# Altium project HPBIController.PrjPCB (part 2 of 2)

## Sheet Power.SchDoc: 02290_Sonoma_Controller
size B; ApprovedBy: J Johnson; CheckedBy: J Johnson; Author: sdfasdfdfAEFfasdFfaF; DrawnBy: J Johnson; Organization: Opsero Electronic Design; Address1: 21-915 Av. Marguerite-Bourgeoys; Address2: Québec (QC); Address3: G1S 3X4; DocumentNumber: OP009-001-SCH; Revision: B-1; SheetNumber: 13; SheetTotal: 16; Tel1: (581) 308-8830; Tel2: (581) 308-8830; Project: 02290_Sonoma_Controller; CheckedDate: 2013-12-13; Sheet: Power Supplies; PageSetup: Record=PageOptions|CenterHorizontal=True|CenterVertical=True|PrintScale=1.08|XCorrection=1.00|YCorrection=1.00|PrintKind=0|BorderSize=5000000|LeftOffset=0|BottomOffset=0|Orientation=2|PaperLength=1000|PaperWidth=1000|Scale=100|PaperSource=7|PrintQuality=-4|MediaType=1|DitherType=10|PaperKind=Tabloid     [11 x 17 in]|PrintScaleMode=1; DrawDate: 2013-12-13; SchTitle: 02290_Sonoma_Controller; RevDescription: Removed QSPI, JP4/5, temp mon, JP6, U31; RevDate: 2019-05-24; RevBy: J Johnson; RevDescription2: Replaced D1 with RB521S30, J2 with L834-1G1T-S7; RevDescription3: Replaced FETs with TSM900N06CW RPG
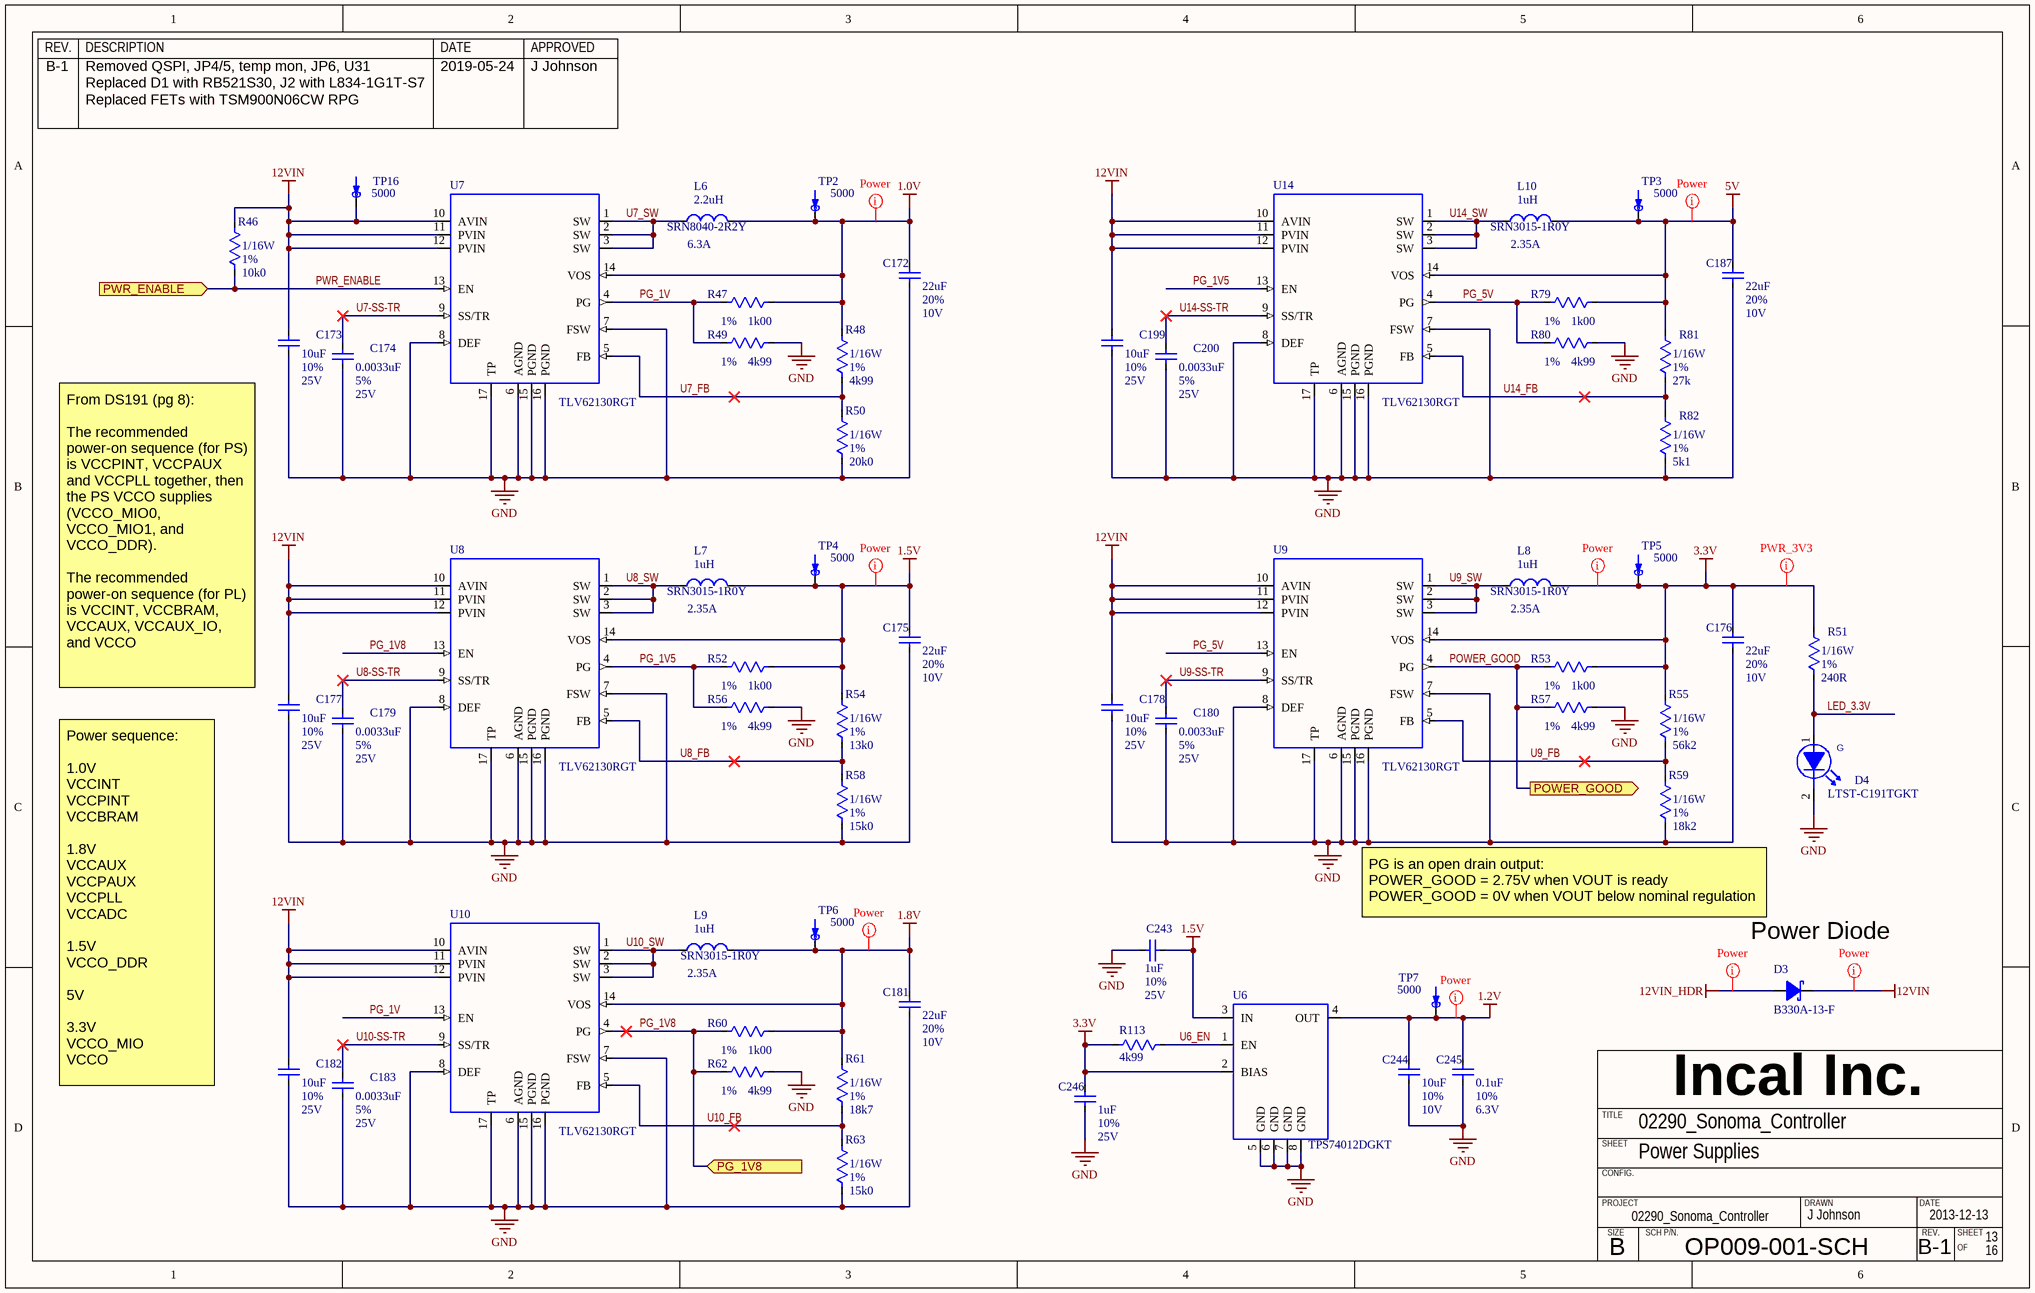
[diagram p3: Power.SchDoc]

### Parts
C172  value 22uF  Tolerance: 20%  Voltage: 10V  [CAPC2013X125N]  (hidden comment: CAPACITOR_NP_TYPE1)
C173  value 10uF  Tolerance: 10%  Voltage: 25V  [CAPC3216X127N]  (hidden comment: CAPACITOR_NP_TYPE1)
C174  value 0.0033uF  Tolerance: 5%  Voltage: 25V  [CAPC1005X55N]  (hidden comment: CAPACITOR_NP_TYPE1)
C175  value 22uF  Tolerance: 20%  Voltage: 10V  [CAPC2013X125N]  (hidden comment: CAPACITOR_NP_TYPE1)
C176  value 22uF  Tolerance: 20%  Voltage: 10V  [CAPC2013X125N]  (hidden comment: CAPACITOR_NP_TYPE1)
C177  value 10uF  Tolerance: 10%  Voltage: 25V  [CAPC3216X127N]  (hidden comment: CAPACITOR_NP_TYPE1)
C178  value 10uF  Tolerance: 10%  Voltage: 25V  [CAPC3216X127N]  (hidden comment: CAPACITOR_NP_TYPE1)
C179  value 0.0033uF  Tolerance: 5%  Voltage: 25V  [CAPC1005X55N]  (hidden comment: CAPACITOR_NP_TYPE1)
C180  value 0.0033uF  Tolerance: 5%  Voltage: 25V  [CAPC1005X55N]  (hidden comment: CAPACITOR_NP_TYPE1)
C181  value 22uF  Tolerance: 20%  Voltage: 10V  [CAPC2013X125N]  (hidden comment: CAPACITOR_NP_TYPE1)
C182  value 10uF  Tolerance: 10%  Voltage: 25V  [CAPC3216X127N]  (hidden comment: CAPACITOR_NP_TYPE1)
C183  value 0.0033uF  Tolerance: 5%  Voltage: 25V  [CAPC1005X55N]  (hidden comment: CAPACITOR_NP_TYPE1)
C187  value 22uF  Tolerance: 20%  Voltage: 10V  [CAPC2013X125N]  (hidden comment: CAPACITOR_NP_TYPE1)
C199  value 10uF  Tolerance: 10%  Voltage: 25V  [CAPC3216X127N]  (hidden comment: CAPACITOR_NP_TYPE1)
C200  value 0.0033uF  Tolerance: 5%  Voltage: 25V  [CAPC1005X55N]  (hidden comment: CAPACITOR_NP_TYPE1)
C243  value 1uF  Tolerance: 10%  Voltage: 25V  [CAPC1608X38N]  (hidden comment: CAPACITOR_NP_TYPE1)
C244  value 10uF  Tolerance: 10%  Voltage: 10V  [CAPC1608X38N]  (hidden comment: CAPACITOR_NP_TYPE1)
C245  value 0.1uF  Tolerance: 10%  Voltage: 6.3V  [CAPC0603X33N]  (hidden comment: CAPACITOR_NP_TYPE1)
C246  value 1uF  Tolerance: 10%  Voltage: 25V  [CAPC1608X38N]  (hidden comment: CAPACITOR_NP_TYPE1)
D3  Mfg Part Number 1: B330A-13-F  [DIOM4629X230N]  (hidden comment: DIODE_SCHOTTKY_TYPE1)
D4  Mfg Part Number 1: LTST-C191TGKT  [LEDM1608X38N-GRN]  (hidden comment: LED_GRN)
L6  value 2.2uH  Current: 6.3A  Mfg Part Number 1: SRN8040-2R2Y  [INDM800800X400N]  (hidden comment: INDUCTOR_TYPE1)
L7  value 1uH  Current: 2.35A  Mfg Part Number 1: SRN3015-1R0Y  [INDM300300X150N]  (hidden comment: INDUCTOR_TYPE1)
L8  value 1uH  Current: 2.35A  Mfg Part Number 1: SRN3015-1R0Y  [INDM300300X150N]  (hidden comment: INDUCTOR_TYPE1)
L9  value 1uH  Current: 2.35A  Mfg Part Number 1: SRN3015-1R0Y  [INDM300300X150N]  (hidden comment: INDUCTOR_TYPE1)
L10  value 1uH  Current: 2.35A  Mfg Part Number 1: SRN3015-1R0Y  [INDM300300X150N]  (hidden comment: INDUCTOR_TYPE1)
R46  value 10k0  Power: 1/16W  Tolerance: 1%  [RESC1005X33N]  (hidden comment: *)
R47  value 1k00  Tolerance: 1%  [RESC1005X33N]  (hidden comment: *)
R48  value 4k99  Power: 1/16W  Tolerance: 1%  [RESC1005X33N]  (hidden comment: *)
R49  value 4k99  Tolerance: 1%  [RESC1005X33N]  (hidden comment: *)
R50  value 20k0  Power: 1/16W  Tolerance: 1%  [RESC1005X33N]  (hidden comment: *)
R51  value 240R  Power: 1/16W  Tolerance: 1%  [RESC1005X33N]  (hidden comment: *)
R52  value 1k00  Tolerance: 1%  [RESC1005X33N]  (hidden comment: *)
R53  value 1k00  Tolerance: 1%  [RESC1005X33N]  (hidden comment: *)
R54  value 13k0  Power: 1/16W  Tolerance: 1%  [RESC1005X33N]  (hidden comment: *)
R55  value 56k2  Power: 1/16W  Tolerance: 1%  [RESC1005X33N]  (hidden comment: *)
R56  value 4k99  Tolerance: 1%  [RESC1005X33N]  (hidden comment: *)
R57  value 4k99  Tolerance: 1%  [RESC1005X33N]  (hidden comment: *)
R58  value 15k0  Power: 1/16W  Tolerance: 1%  [RESC1005X33N]  (hidden comment: *)
R59  value 18k2  Power: 1/16W  Tolerance: 1%  [RESC1005X33N]  (hidden comment: *)
R60  value 1k00  Tolerance: 1%  [RESC1005X33N]  (hidden comment: *)
R61  value 18k7  Power: 1/16W  Tolerance: 1%  [RESC1005X33N]  (hidden comment: *)
R62  value 4k99  Tolerance: 1%  [RESC1005X33N]  (hidden comment: *)
R63  value 15k0  Power: 1/16W  Tolerance: 1%  [RESC1005X33N]  (hidden comment: *)
R79  value 1k00  Tolerance: 1%  [RESC1005X33N]  (hidden comment: *)
R80  value 4k99  Tolerance: 1%  [RESC1005X33N]  (hidden comment: *)
R81  value 27k  Power: 1/16W  Tolerance: 1%  [RESC1005X33N]  (hidden comment: *)
R82  value 5k1  Power: 1/16W  Tolerance: 1%  [RESC1005X33N]  (hidden comment: *)
R113  value 4k99  [RESC1005X33N]  (hidden comment: *)
TP2  value 5000  [KEY_5000]  (hidden comment: TEST_POINT_TYPE4)
TP3  value 5000  [KEY_5000]  (hidden comment: TEST_POINT_TYPE4)
TP4  value 5000  [KEY_5000]  (hidden comment: TEST_POINT_TYPE4)
TP5  value 5000  [KEY_5000]  (hidden comment: TEST_POINT_TYPE4)
TP6  value 5000  [KEY_5000]  (hidden comment: TEST_POINT_TYPE4)
TP7  value 5000  [KEY_5000]  (hidden comment: TEST_POINT_TYPE4)
TP16  value 5000  [KEY_5000]  (hidden comment: TEST_POINT_TYPE4)
U6  Mfg Part Number 1: TPS74012DGKT  [SOP65P490X110-8N]  (hidden comment: TPS740XXDGK)
U7  TLV62130RGT  [QFN50P300X300X100-17N]
U8  TLV62130RGT  [QFN50P300X300X100-17N]
U9  TLV62130RGT  [QFN50P300X300X100-17N]
U10  TLV62130RGT  [QFN50P300X300X100-17N]
U14  TLV62130RGT  [QFN50P300X300X100-17N]

### Ports
PG_1V8 (in), POWER_GOOD (out), PWR_ENABLE (in)

### Nets
1.0V: C172.1 L6.2 R47.2 R48.2 TP2.1 U7.14(VOS)
1.2V: C244.1 C245.1 TP7.1 U6.4(OUT)
1.5V: C175.1 C243.1 L7.2 R52.2 R54.2 TP4.1 U6.3(IN) U8.14(VOS)
1.8V: C181.1 L9.2 R60.2 R61.2 TP6.1 U10.14(VOS)
3.3V: C176.1 C246.1 L8.2 R51.1 R53.2 R55.2 R113.2 TP5.1 U6.2(BIAS) U9.14(VOS)
5V: C187.1 L10.2 R79.2 R81.2 TP3.1 U14.14(VOS)
12VIN: C173.1 C177.1 C178.1 C182.1 C199.1 D3.2(K) R46.2 TP16.1 U7.10(AVIN) U7.11(PVIN) U7.12(PVIN) U8.10(AVIN) U8.11(PVIN) U8.12(PVIN) U9.10(AVIN) U9.11(PVIN) U9.12(PVIN) U10.10(AVIN) U10.11(PVIN) U10.12(PVIN) U14.10(AVIN) U14.11(PVIN) U14.12(PVIN)
12VIN_HDR: D3.1(A)
GND: C172.2 C173.2 C174.2 C175.2 C176.2 C177.2 C178.2 C179.2 C180.2 C181.2 C182.2 C183.2 C187.2 C199.2 C200.2 C243.2 C244.2 C245.2 C246.2 D4.2(K) R49.2 R50.1 R56.2 R57.2 R58.1 R59.1 R62.2 R63.1 R80.2 R82.1 U6.5(GND) U6.6(GND) U6.7(GND) U6.8(GND) U7.6(AGND) U7.7(FSW) U7.8(DEF) U7.15(PGND) U7.16(PGND) U7.17(TP) U8.6(AGND) U8.7(FSW) U8.8(DEF) U8.15(PGND) U8.16(PGND) U8.17(TP) U9.6(AGND) U9.7(FSW) U9.8(DEF) U9.15(PGND) U9.16(PGND) U9.17(TP) U10.6(AGND) U10.7(FSW) U10.8(DEF) U10.15(PGND) U10.16(PGND) U10.17(TP) U14.6(AGND) U14.7(FSW) U14.8(DEF) U14.15(PGND) U14.16(PGND) U14.17(TP)
LED_3.3V: D4.1(A) R51.2
PG_1V: R47.1 R49.1 U7.4(PG) U10.13(EN)
PG_1V5: R52.1 R56.1 U8.4(PG) U14.13(EN)
PG_1V8: R60.1 R62.1 U8.13(EN) U10.4(PG) ; port PG_1V8
PG_5V: R79.1 R80.1 U9.13(EN) U14.4(PG)
POWER_GOOD: R53.1 R57.1 U9.4(PG) ; port POWER_GOOD
PWR_ENABLE: R46.1 U7.13(EN) ; port PWR_ENABLE
U6_EN: R113.1 U6.1(EN)
U7-SS-TR: C174.1 U7.9(SS/TR)
U7_FB: R48.1 R50.2 U7.5(FB)
U7_SW: L6.1 U7.1(SW) U7.2(SW) U7.3(SW)
U8-SS-TR: C179.1 U8.9(SS/TR)
U8_FB: R54.1 R58.2 U8.5(FB)
U8_SW: L7.1 U8.1(SW) U8.2(SW) U8.3(SW)
U9-SS-TR: C180.1 U9.9(SS/TR)
U9_FB: R55.1 R59.2 U9.5(FB)
U9_SW: L8.1 U9.1(SW) U9.2(SW) U9.3(SW)
U10-SS-TR: C183.1 U10.9(SS/TR)
U10_FB: R61.1 R63.2 U10.5(FB)
U10_SW: L9.1 U10.1(SW) U10.2(SW) U10.3(SW)
U14-SS-TR: C200.1 U14.9(SS/TR)
U14_FB: R81.1 R82.2 U14.5(FB)
U14_SW: L10.1 U14.1(SW) U14.2(SW) U14.3(SW)

### Layout directives
net class Power_3V3: 3.3V
net class Power: 1.0V, 1.2V, 1.5V, 1.8V, 3.3V, 5V, 12VIN, 12VIN_HDR

### Notes on the sheet
- From DS191 (pg 8):
  The recommended power-on sequence (for PS) is VCCPINT, VCCPAUX and VCCPLL together, then the PS VCCO supplies (VCCO_MIO0, VCCO_MIO1, and VCCO_DDR).
  The recommended power-on sequence (for PL) is VCCINT, VCCBRAM, VCCAUX, VCCAUX_IO, and VCCO
- (near R59) PG is an open drain output:
  POWER_GOOD = 2.75V when VOUT is ready
  POWER_GOOD = 0V when VOUT below nominal regulation
- (near D3) Power Diode
- Power sequence:
  1.0V
  VCCINT
  VCCPINT
  VCCBRAM
  1.8V
  VCCAUX
  VCCPAUX
  VCCPLL
  VCCADC
  1.5V
  VCCO_DDR
  5V
  3.3V
  VCCO_MIO
  VCCO
- REV.
- DESCRIPTION
- DATE
- APPROVED
- Incal Inc.
- SHEET
- TITLE
- CONFIG.
- PROJECT
- SIZE
- SCH P/N.
- DRAWN
- B
- OF
- (in symbol LTST-C191TGKT) G

### Library data of the parts
C172 C175 C176 C181 C187 = C0805_22uF_20%_10V_X5R: Capacitor ceramic, X5R, 22uF, 10V, 20%, -55 to +85 C, EIA0805; Manufacturer 1: Taiyo; Mfg Part Number 1: LMK212BJ226MG-T; EIA(I) Package: 0805; EIA(M) Package: 2012; ASSY: USED; Status: Active; Power: *; Current: *; Part Ref: C0805_22uF_20%_10V_X5R; Comment_1: *; RoHs: True; Operating Temp: -55 to +85 C
C173 C177 C178 C182 C199 = C1206_10uF_10%_25V_X5R: Capacitor ceramic, X5R, 10uF, 25V, 10%, -55 to +125 C, EIA1206; Manufacturer 1: AVX; Mfg Part Number 1: 12063D106KAT2A; EIA(I) Package: 1206; EIA(M) Package: 3216; ASSY: USED; Status: Active; Power: *; Current: *; Part Ref: C1206_10uF_10%_25V_X5R; Comment_1: *; RoHs: True; Operating Temp: -55 to +125 C
C174 C179 C180 C183 C200 = C0402_0.0033uF_5%_25V_X7R: Capacitor ceramic, X7R, 0.0033uF, 25V, 5%, -55 to +85 C, EIA0402; Manufacturer 1: AVX; Mfg Part Number 1: 04023C332JAT2A; EIA(I) Package: 0402; EIA(M) Package: 1005; ASSY: USED; Status: Active; Power: *; Current: *; Part Ref: C0402_0.0033uF_5%_25V_X7R; Comment_1: *; RoHs: True; Operating Temp: -55 to +85 C
C243 C246 = C0603_1uF_10%_25V_X5R: Capacitor ceramic, X5R, 1uF, 25V, 10%, -55 to +85 C, EIA(M)1608; Manufacturer 1: TDK; Mfg Part Number 1: C1608X5R1E105K080AC; EIA(I) Package: 0603; EIA(M) Package: 1608; ASSY: USED; Status: Active; Power: *; Current: *; Part Ref: C0603_1uF_10%_25V_X5R; Comment_1: *; RoHs: True; Operating Temp: -55 to +85 C; Datasheet 1: ..\datasheet\Capacitor\TDK\C Series\2012-10-26
C244 = C0603_10uF_10%_10V_X5R: Capacitor ceramic, X5R, 10uF, 10V, 10%, -55 to +85 C, EIA0603; Manufacturer 1: TDK Corporation; Mfg Part Number 1: C1608X5R1A106K080AC; EIA(I) Package: 0603; EIA(M) Package: 1608; ASSY: USED; Status: Active; Power: *; Current: *; Part Ref: C0603_10uF_10%_10V_X5R; Comment_1: *; RoHs: True; Operating Temp: -55 to +85 C
C245 = C0201_0.1uF_10%_6.3V_X5R: Capacitor ceramic, X5R, 0.1uF, 6.3V, 10%, -55 to +125 C, EIA0201; Manufacturer 1: Murata; Mfg Part Number 1: GRM033R60J104KE19D; EIA(I) Package: 0201; EIA(M) Package: 0603; ASSY: USED; Status: Active; Power: *; Current: *; Part Ref: C0201_0.1uF_10%_6.3V_X5R; Comment_1: *; RoHs: True; Operating Temp: -55 to +85 C
D3 = B330A-13-F: Diode, Schottky, Vz = 30V, -55 to 125C, SMT; Manufacturer 1: Diodes Inc; Current: 3A; ASSY: USED; Voltage: Vz= 30V; Status: Active; Power: *; EIA(I) Package: *; EIA(M) Package: *; Part Ref: B330A-13-F; Tolerance: *; Comment_1: *; RoHs: True; Value: B330A-13-F; Operating Temp: -55 to +125 C
D4 = LTST-C191TGKT: Led, Green, 150mcd, SMT, LTST-C191TGKT, -20 to +80 C, 0603; Manufacturer 1: LITE-ON; EIA(I) Package: 0603; ASSY: USED; Power: Pow; Current: 20mA; Voltage: 3.2V; Status: Active; EIA(M) Package: *; Part Ref: LTST-C191TGKT; Tolerance: *; Package: *; RoHs: True; Value: LTST-C191TGKT; Operating Temp: -20 to +80 C
L6 = SRN8040-2R2Y: Inductor, shielded, 13mOhm, 2.2uH, 6.3A, 30%, -40 to +105 C; Manufacturer 1: Bourns; ASSY: USED; Status: Active; Power: *; EIA(I) Package: *; EIA(M) Package: *; Part Ref: SRN8040-2R2Y; Voltage: *; Comment_1: *; RoHs: True; Tolerance: 30%; Operating Temp: -40 to +105 C
L7-L10 = SRN3015-1R0Y: Inductor, shielded, 48mOhm, 1uH, 2.35A, 30%, -40 to +125 C; Manufacturer 1: Bourns; ASSY: USED; Status: Active; Power: *; EIA(I) Package: *; EIA(M) Package: *; Part Ref: SRN3015-1R0Y; Voltage: *; Comment_1: *; RoHs: True; Tolerance: 30%; Operating Temp: -40 to +125 C
R46 = R0402_10k0_1%: Resistor, 10k0, 1/16W, 1%, -55 to +155 C, EIA0402; Manufacturer 1: Yageo; Mfg Part Number 1: RC0402FR-0710k0L; EIA(I) Package: 0402; EIA(M) Package: 1005; Voltage: 50V; ASSY: USED; Status: Active; Part Ref: R0402_10k0_1%; Current: *; Comment_1: *; RoHs: True; Package: 0402; Operating Temp: -55 to +155 C; Datasheet 1: ..\datasheet\Resistor\Yaego\Thick_Film\RC0402\2012-03-29; Manufacturer 2: Vishay Dale; Mfg Part Number 2: CRCW040210k0FKED; Datasheet 2: ..\datasheet\Resistor\Vishay Dale\CRC\2012-03-29
R47 R52 R53 R60 R79 = R0402_1k00_1%: Resistor, 1k00, 1/16W, 1%, -55 to +155 C, EIA0402; Manufacturer 1: Yageo; Mfg Part Number 1: RC0402FR-071K00L; EIA(I) Package: 0402; EIA(M) Package: 1005; Voltage: 50V; ASSY: USED; Status: Active; Part Ref: R0402_1k00_1%; Current: *; Comment_1: *; RoHs: True; Power: 1/16W; Operating Temp: -55 to +155 C; Datasheet 1: ..\datasheet\Resistor\Yaego\Thick_Film\RC0402\2012-03-29; Manufacturer 2: Vishay Dale; Mfg Part Number 2: CRCW04021k00FKED; Datasheet 2: ..\datasheet\Resistor\Vishay Dale\CRC\2012-03-29
R48 R49 R56 R57 R62 R80 R113 = R0402_4k99_1%: Resistor, 4k99, 1/16W, 1%, -50 to +155 C, EIA0402, EIA(M)1005; Manufacturer 1: Yageo; Mfg Part Number 1: RC0402FR-074k99L; EIA(I) Package: 0402; EIA(M) Package: 1005; Voltage: 50V; ASSY: USED; Status: Active; Part Ref: R0402_4k99_1%; Current: *; Comment_1: *; RoHs: True; Operating Temp: -50 to +155 C; Datasheet 1: ..\datasheet\Resistor\Yaego\Thick_Film\RC0402\2012-03-29; Manufacturer 2: Vishay Dale; Mfg Part Number 2: CRCW04024k99FKED; Datasheet 2: ..\datasheet\Resistor\Vishay Dale\CRC\2012-03-29
  R49 R56 R57 R62 R80: Power: 1/16W
  R113: Power: 1/16W; Tolerance: 1%
R50 = R0402_20k0_1%: Resistor, 20k0, 1/16W, 1%, -50 to +155 C, EIA0402, EIA(M)1005; Manufacturer 1: Yageo; Mfg Part Number 1: RC0402FR-0720k0L; EIA(I) Package: 0402; EIA(M) Package: 1005; Voltage: 50V; ASSY: USED; Status: Active; Part Ref: R0402_20k0_1%; Current: *; Comment_1: *; RoHs: True; Operating Temp: -50 to +155 C; Datasheet 1: ..\datasheet\Resistor\Yaego\Thick_Film\RC0402\2012-03-29; Manufacturer 2: Vishay Dale; Mfg Part Number 2: CRCW040220k0FKED; Datasheet 2: ..\datasheet\Resistor\Vishay Dale\CRC\2012-03-29
R51 = R0402_240R_1%: Resistor, 240R, 1/16W, 1%, -50 to +155 C, EIA0402, EIA(M)1005; Manufacturer 1: Vishay Dale; Mfg Part Number 1: CRCW0402240RFKED; EIA(I) Package: 0402; EIA(M) Package: 1005; Voltage: 50V; ASSY: USED; Status: Active; Part Ref: R0402_240R_1%; Current: *; Comment_1: *; RoHs: True; Operating Temp: -50 to +155 C
R54 = R0402_13k0_1%: Resistor, 13k0, 1/16W, 1%, -50 to +155 C, EIA0402, EIA(M)1005; Manufacturer 1: Yageo; Mfg Part Number 1: RC0402FR-0713k0L; EIA(I) Package: 0402; EIA(M) Package: 1005; Voltage: 50V; ASSY: USED; Status: Active; Part Ref: R0402_13k0_1%; Current: *; Comment_1: *; RoHs: True; Operating Temp: -50 to +155 C; Datasheet 1: ..\datasheet\Resistor\Yaego\Thick_Film\RC0402\2012-03-29; Manufacturer 2: Vishay Dale; Mfg Part Number 2: CRCW040213k0FKED; Datasheet 2: ..\datasheet\Resistor\Vishay Dale\CRC\2012-03-29
R55 = R0402_56k2_1%: Resistor, 56k2, 1/16W, 1%, -50 to +155 C, EIA0402, EIA(M)1005; Manufacturer 1: Yageo; Mfg Part Number 1: RC0402FR-0756k2L; EIA(I) Package: 0402; EIA(M) Package: 1005; Voltage: 50V; ASSY: USED; Status: Active; Part Ref: R0402_56k2_1%; Current: *; Comment_1: *; RoHs: True; Operating Temp: -50 to +155 C; Datasheet 1: ..\datasheet\Resistor\Yaego\Thick_Film\RC0402\2012-03-29; Manufacturer 2: Vishay Dale; Mfg Part Number 2: CRCW040256k2FKED; Datasheet 2: ..\datasheet\Resistor\Vishay Dale\CRC\2012-03-29
R58 R63 = R0402_15k0_1%: Resistor, 15k0, 1/16W, 1%, -50 to +155 C, EIA0402, EIA(M)1005; Manufacturer 1: Yageo; Mfg Part Number 1: RC0402FR-0715k0L; EIA(I) Package: 0402; EIA(M) Package: 1005; Voltage: 50V; ASSY: USED; Status: Active; Part Ref: R0402_15k0_1%; Current: *; Comment_1: *; RoHs: True; Operating Temp: -50 to +155 C; Datasheet 1: ..\datasheet\Resistor\Yaego\Thick_Film\RC0402\2012-03-29; Manufacturer 2: Vishay Dale; Mfg Part Number 2: CRCW040215k0FKED; Datasheet 2: ..\datasheet\Resistor\Vishay Dale\CRC\2012-03-29
R59 = R0402_18k2_1%: Resistor, 18k2, 1/16W, 1%, -50 to +155 C, EIA0402, EIA(M)1005; Manufacturer 1: Yageo; Mfg Part Number 1: RC0402FR-0718k2L; EIA(I) Package: 0402; EIA(M) Package: 1005; Voltage: 50V; ASSY: USED; Status: Active; Part Ref: R0402_18k2_1%; Current: *; Comment_1: *; RoHs: True; Operating Temp: -50 to +155 C; Datasheet 1: ..\datasheet\Resistor\Yaego\Thick_Film\RC0402\2012-03-29; Manufacturer 2: Vishay Dale; Mfg Part Number 2: CRCW040218k2FKED; Datasheet 2: ..\datasheet\Resistor\Vishay Dale\CRC\2012-03-29
R61 = R0402_18k7_1%: Resistor, 18k7, 1/16W, 1%, -50 to +155 C, EIA0402, EIA(M)1005; Manufacturer 1: Yageo; Mfg Part Number 1: RC0402FR-0718k7L; EIA(I) Package: 0402; EIA(M) Package: 1005; Voltage: 50V; ASSY: USED; Status: Active; Part Ref: R0402_18k7_1%; Current: *; Comment_1: *; RoHs: True; Operating Temp: -50 to +155 C; Datasheet 1: ..\datasheet\Resistor\Yaego\Thick_Film\RC0402\2012-03-29; Manufacturer 2: Vishay Dale; Mfg Part Number 2: CRCW040218k7FKED; Datasheet 2: ..\datasheet\Resistor\Vishay Dale\CRC\2012-03-29
R81 = R0402_27k0_1%: Resistor, 27k0, 1/16W, 1%, -50 to +155 C, EIA0402, EIA(M)1005; Manufacturer 1: Yageo; Mfg Part Number 1: RC0402FR-0727kL; EIA(I) Package: 0402; EIA(M) Package: 1005; Voltage: 50V; ASSY: USED; Status: Active; Part Ref: R0402_27k0_1%; Current: *; Comment_1: *; RoHs: True; Operating Temp: -50 to +155 C; Datasheet 1: ..\datasheet\Resistor\Yaego\Thick_Film\RC0402\2012-03-29; Manufacturer 2: Vishay Dale; Mfg Part Number 2: CRCW040227k0FKED; Datasheet 2: ..\datasheet\Resistor\Vishay Dale\CRC\2012-03-29
R82 = R0402_5k10_1%: Resistor, 5k10, 1/16W, 1%, -50 to +155 C, EIA0402, EIA(M)1005; Manufacturer 1: Yageo; Mfg Part Number 1: RC0402FR-075k1L; EIA(I) Package: 0402; EIA(M) Package: 1005; Voltage: 50V; ASSY: USED; Status: Active; Part Ref: R0402_5k10_1%; Current: *; Comment_1: *; RoHs: True; Operating Temp: -50 to +155 C; Datasheet 1: ..\datasheet\Resistor\Yaego\Thick_Film\RC0402\2012-03-29; Manufacturer 2: Vishay Dale; Mfg Part Number 2: CRCW04025k10FKED; Datasheet 2: ..\datasheet\Resistor\Vishay Dale\CRC\2012-03-29
TP2-TP7 TP16 = 5000: Test point bead, red, Keystone Electronics, Thru-hole,; Manufacturer 1: Keystone inc; ASSY: USED; Power: Pow; Current: Cur; Voltage: Vol; Comment_1: Com; Status: Active; EIA(I) Package: *; EIA(M) Package: *; Part Ref: 5000; Tolerance: *; Package: *; RoHs: True; Mfg Part Number 1: 5000; Datasheet 1: ..\datasheet\Connector\Keystone Electronics\5001-5014\2012-06-28
U6 = TPS74012DGKT: Fixed 1.2V LDO Regulator with Dual Input Voltages, -40 to +85 C; Manufacturer 1: Texas Instruments; Current: 1.5A; PART NUMBER: TPS740XXDGK; Part Ref: TPS74012DGKT; Status: Active; RoHs: True; Value: TPS74012DGKT; Voltage: 1.2V; Operating Temp: -40 to +125 C
U7-U10 U14 = TLV62130RGT: Step-Down Converter with DCS-Control, 4-17V 3A, 16QFN; Manufacturer 1: Texas Instruments; Voltage: 4 to 17V; PART NUMBER: TLV62130RGT; Part Ref: TLV62130RGT; Status: Active; RoHs: True; Value: TLV62130RGT; Current: 3A; Operating Temp: -40 to +85 C; Mfg Part Number 1: TLV62130RGT

## Sheet ADC.SchDoc: 02290_Sonoma_Controller
size B; ApprovedBy: J Johnson; CheckedBy: J Johnson; Author: sdfasdfdfAEFfasdFfaF; DrawnBy: J Johnson; Organization: Opsero Electronic Design; Address1: 21-915 Av. Marguerite-Bourgeoys; Address2: Québec (QC); Address3: G1S 3X4; DocumentNumber: OP009-001-SCH; Revision: B-1; SheetNumber: 15; SheetTotal: 16; Tel1: (581) 308-8830; Tel2: (581) 308-8830; Project: 02290_Sonoma_Controller; CheckedDate: 2013-12-13; Sheet: ADC 3Msps 12-bit 16-channel; PageSetup: Record=PageOptions|CenterHorizontal=True|CenterVertical=True|PrintScale=1.08|XCorrection=1.00|YCorrection=1.00|PrintKind=0|BorderSize=5000000|LeftOffset=0|BottomOffset=0|Orientation=2|PaperLength=1000|PaperWidth=1000|Scale=100|PaperSource=7|PrintQuality=-4|MediaType=1|DitherType=10|PaperKind=Tabloid     [11 x 17 in]|PrintScaleMode=1; DrawDate: 2013-12-13; SchTitle: 02290_Sonoma_Controller; RevDescription: Removed QSPI, JP4/5, temp mon, JP6, U31; RevDate: 2019-05-24; RevBy: J Johnson; RevDescription2: Replaced D1 with RB521S30, J2 with L834-1G1T-S7; RevDescription3: Replaced FETs with TSM900N06CW RPG
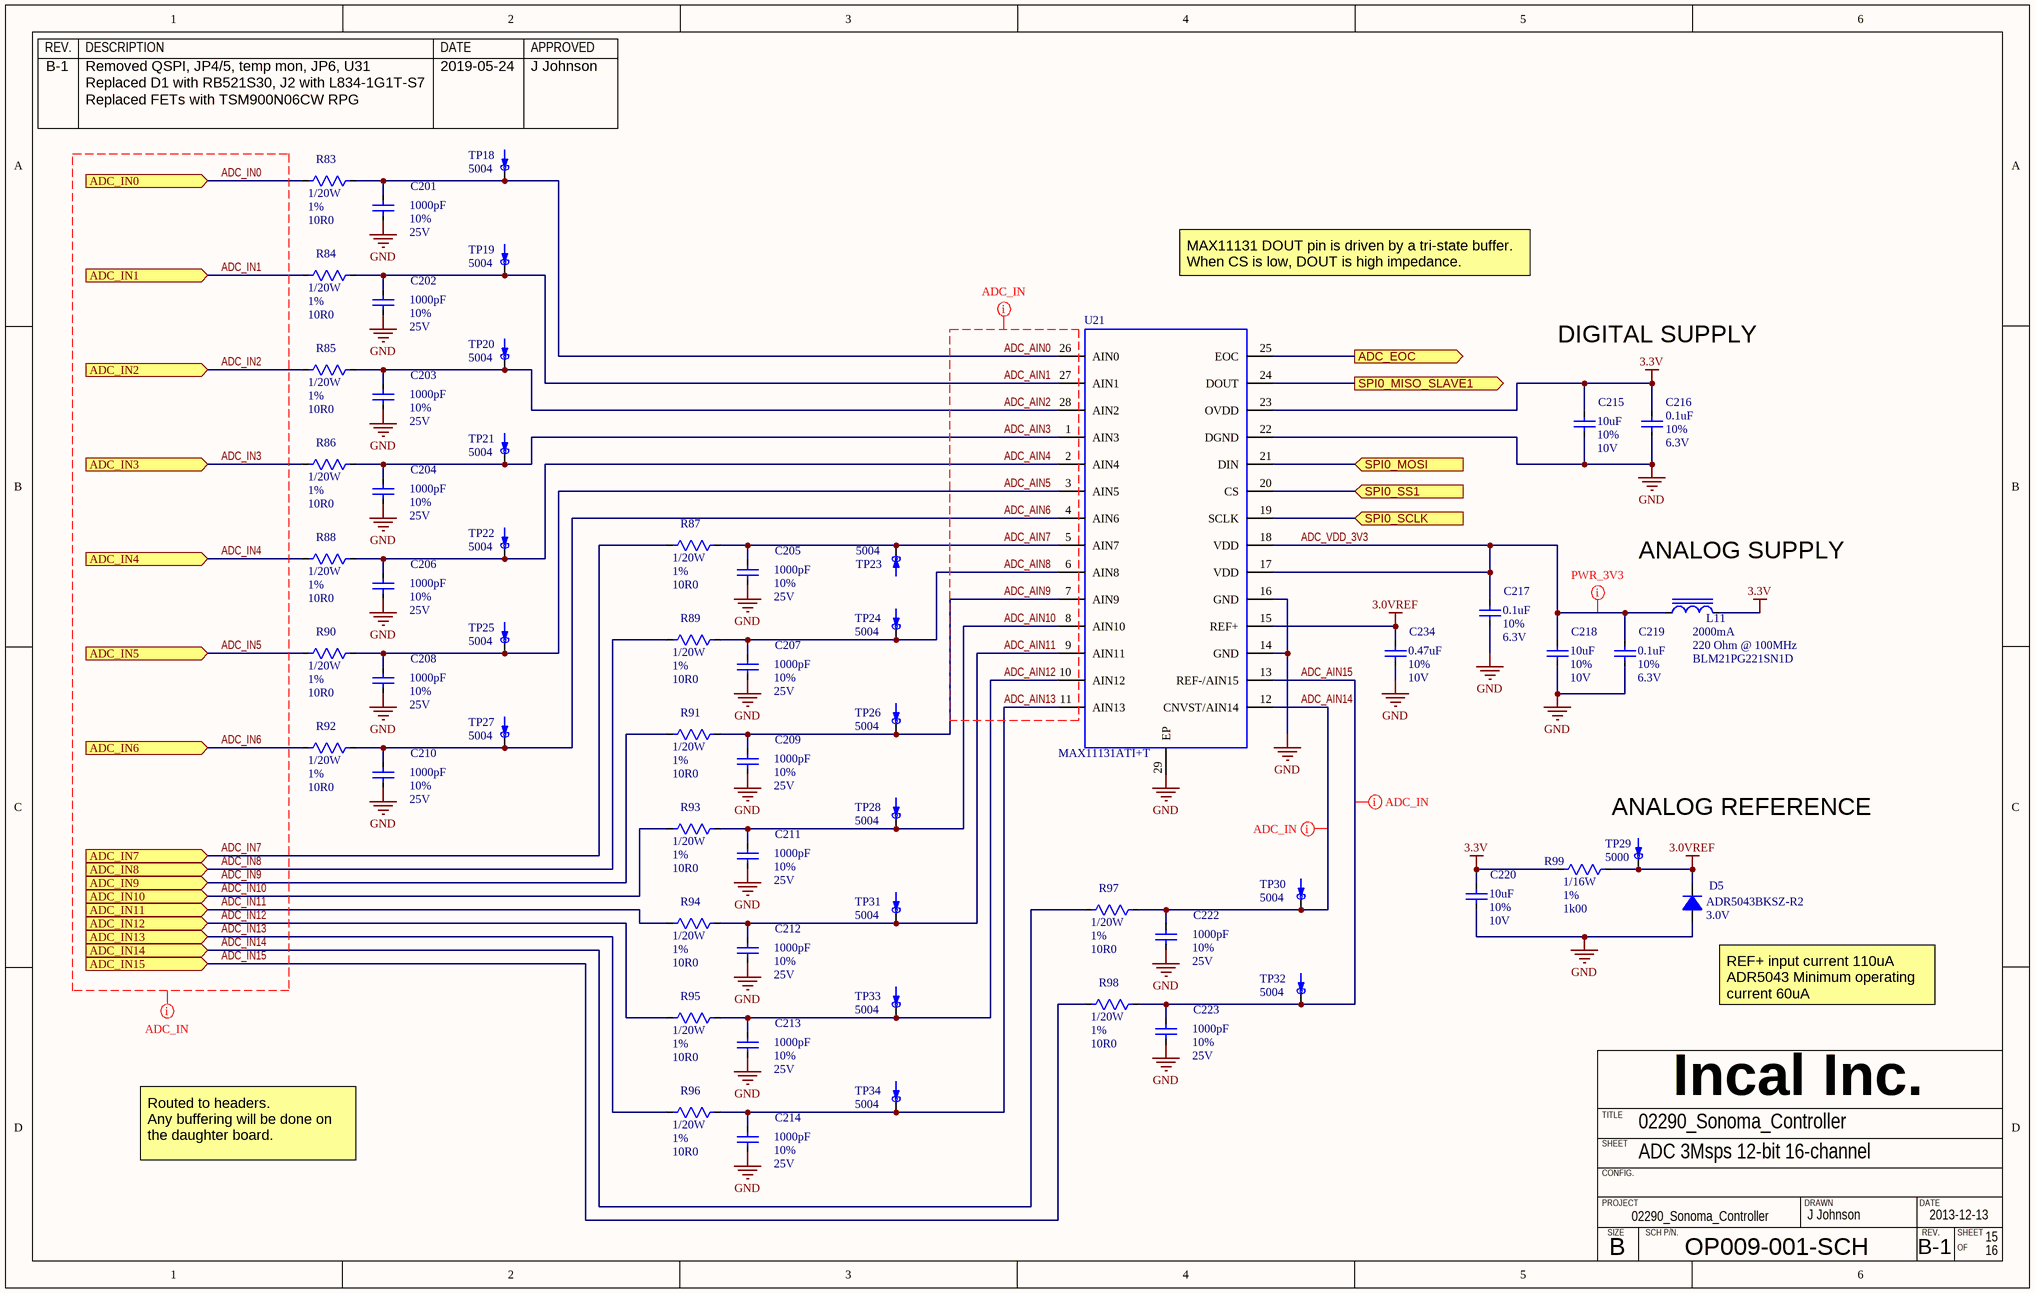
[diagram p4: ADC.SchDoc]

### Parts
C201  value 1000pF  Tolerance: 10%  Voltage: 25V  [CAPC0603X33N]  (hidden comment: CAPACITOR_NP_TYPE1)
C202  value 1000pF  Tolerance: 10%  Voltage: 25V  [CAPC0603X33N]  (hidden comment: CAPACITOR_NP_TYPE1)
C203  value 1000pF  Tolerance: 10%  Voltage: 25V  [CAPC0603X33N]  (hidden comment: CAPACITOR_NP_TYPE1)
C204  value 1000pF  Tolerance: 10%  Voltage: 25V  [CAPC0603X33N]  (hidden comment: CAPACITOR_NP_TYPE1)
C205  value 1000pF  Tolerance: 10%  Voltage: 25V  [CAPC0603X33N]  (hidden comment: CAPACITOR_NP_TYPE1)
C206  value 1000pF  Tolerance: 10%  Voltage: 25V  [CAPC0603X33N]  (hidden comment: CAPACITOR_NP_TYPE1)
C207  value 1000pF  Tolerance: 10%  Voltage: 25V  [CAPC0603X33N]  (hidden comment: CAPACITOR_NP_TYPE1)
C208  value 1000pF  Tolerance: 10%  Voltage: 25V  [CAPC0603X33N]  (hidden comment: CAPACITOR_NP_TYPE1)
C209  value 1000pF  Tolerance: 10%  Voltage: 25V  [CAPC0603X33N]  (hidden comment: CAPACITOR_NP_TYPE1)
C210  value 1000pF  Tolerance: 10%  Voltage: 25V  [CAPC0603X33N]  (hidden comment: CAPACITOR_NP_TYPE1)
C211  value 1000pF  Tolerance: 10%  Voltage: 25V  [CAPC0603X33N]  (hidden comment: CAPACITOR_NP_TYPE1)
C212  value 1000pF  Tolerance: 10%  Voltage: 25V  [CAPC0603X33N]  (hidden comment: CAPACITOR_NP_TYPE1)
C213  value 1000pF  Tolerance: 10%  Voltage: 25V  [CAPC0603X33N]  (hidden comment: CAPACITOR_NP_TYPE1)
C214  value 1000pF  Tolerance: 10%  Voltage: 25V  [CAPC0603X33N]  (hidden comment: CAPACITOR_NP_TYPE1)
C215  value 10uF  Tolerance: 10%  Voltage: 10V  [CAPC1608X38N]  (hidden comment: CAPACITOR_NP_TYPE1)
C216  value 0.1uF  Tolerance: 10%  Voltage: 6.3V  [CAPC0603X33N]  (hidden comment: CAPACITOR_NP_TYPE1)
C217  value 0.1uF  Tolerance: 10%  Voltage: 6.3V  [CAPC0603X33N]  (hidden comment: CAPACITOR_NP_TYPE1)
C218  value 10uF  Tolerance: 10%  Voltage: 10V  [CAPC1608X38N]  (hidden comment: CAPACITOR_NP_TYPE1)
C219  value 0.1uF  Tolerance: 10%  Voltage: 6.3V  [CAPC0603X33N]  (hidden comment: CAPACITOR_NP_TYPE1)
C220  value 10uF  Tolerance: 10%  Voltage: 10V  [CAPC1608X38N]  (hidden comment: CAPACITOR_NP_TYPE1)
C222  value 1000pF  Tolerance: 10%  Voltage: 25V  [CAPC0603X33N]  (hidden comment: CAPACITOR_NP_TYPE1)
C223  value 1000pF  Tolerance: 10%  Voltage: 25V  [CAPC0603X33N]  (hidden comment: CAPACITOR_NP_TYPE1)
C234  value 0.47uF  Tolerance: 10%  Voltage: 10V  [CAPC1005X55N]  (hidden comment: CAPACITOR_NP_TYPE1)
D5  value 3.0V  Mfg Part Number 1: ADR5043BKSZ-R2  [SOT65P210X110-3N]  (hidden comment: DIODE_TYPE3)
L11  value 220 Ohm @ 100MHz  Current: 2000mA  Mfg Part Number 1: BLM21PG221SN1D  [INDC2012X85N]  (hidden comment: INDUCTOR_CORE_TYPE1)
R83  value 10R0  Power: 1/20W  Tolerance: 1%  [RESC1005X33N]  (hidden comment: *)
R84  value 10R0  Power: 1/20W  Tolerance: 1%  [RESC1005X33N]  (hidden comment: *)
R85  value 10R0  Power: 1/20W  Tolerance: 1%  [RESC1005X33N]  (hidden comment: *)
R86  value 10R0  Power: 1/20W  Tolerance: 1%  [RESC1005X33N]  (hidden comment: *)
R87  value 10R0  Power: 1/20W  Tolerance: 1%  [RESC1005X33N]  (hidden comment: *)
R88  value 10R0  Power: 1/20W  Tolerance: 1%  [RESC1005X33N]  (hidden comment: *)
R89  value 10R0  Power: 1/20W  Tolerance: 1%  [RESC1005X33N]  (hidden comment: *)
R90  value 10R0  Power: 1/20W  Tolerance: 1%  [RESC1005X33N]  (hidden comment: *)
R91  value 10R0  Power: 1/20W  Tolerance: 1%  [RESC1005X33N]  (hidden comment: *)
R92  value 10R0  Power: 1/20W  Tolerance: 1%  [RESC1005X33N]  (hidden comment: *)
R93  value 10R0  Power: 1/20W  Tolerance: 1%  [RESC1005X33N]  (hidden comment: *)
R94  value 10R0  Power: 1/20W  Tolerance: 1%  [RESC1005X33N]  (hidden comment: *)
R95  value 10R0  Power: 1/20W  Tolerance: 1%  [RESC1005X33N]  (hidden comment: *)
R96  value 10R0  Power: 1/20W  Tolerance: 1%  [RESC1005X33N]  (hidden comment: *)
R97  value 10R0  Power: 1/20W  Tolerance: 1%  [RESC1005X33N]  (hidden comment: *)
R98  value 10R0  Power: 1/20W  Tolerance: 1%  [RESC1005X33N]  (hidden comment: *)
R99  value 1k00  Power: 1/16W  Tolerance: 1%  [RESC1005X33N]  (hidden comment: *)
TP18  value 5004  [KEY_5004]  (hidden comment: TEST_POINT_TYPE4)
TP19  value 5004  [KEY_5004]  (hidden comment: TEST_POINT_TYPE4)
TP20  value 5004  [KEY_5004]  (hidden comment: TEST_POINT_TYPE4)
TP21  value 5004  [KEY_5004]  (hidden comment: TEST_POINT_TYPE4)
TP22  value 5004  [KEY_5004]  (hidden comment: TEST_POINT_TYPE4)
TP23  value 5004  [KEY_5004]  (hidden comment: TEST_POINT_TYPE4)
TP24  value 5004  [KEY_5004]  (hidden comment: TEST_POINT_TYPE4)
TP25  value 5004  [KEY_5004]  (hidden comment: TEST_POINT_TYPE4)
TP26  value 5004  [KEY_5004]  (hidden comment: TEST_POINT_TYPE4)
TP27  value 5004  [KEY_5004]  (hidden comment: TEST_POINT_TYPE4)
TP28  value 5004  [KEY_5004]  (hidden comment: TEST_POINT_TYPE4)
TP29  value 5000  [KEY_5000]  (hidden comment: TEST_POINT_TYPE4)
TP30  value 5004  [KEY_5004]  (hidden comment: TEST_POINT_TYPE4)
TP31  value 5004  [KEY_5004]  (hidden comment: TEST_POINT_TYPE4)
TP32  value 5004  [KEY_5004]  (hidden comment: TEST_POINT_TYPE4)
TP33  value 5004  [KEY_5004]  (hidden comment: TEST_POINT_TYPE4)
TP34  value 5004  [KEY_5004]  (hidden comment: TEST_POINT_TYPE4)
U21  MAX11131ATI+T  [TQFN50P500X500X75-28N]

### Ports
ADC_EOC (out), ADC_IN0 (in), ADC_IN1 (in), ADC_IN2 (in), ADC_IN3 (in), ADC_IN4 (in), ADC_IN5 (in), ADC_IN6 (in), ADC_IN7 (in), ADC_IN8 (in), ADC_IN9 (in), ADC_IN10 (in), ADC_IN11 (in), ADC_IN12 (in), ADC_IN13 (in), ADC_IN14 (in), ADC_IN15 (in), SPI0_MISO_SLAVE1 (out), SPI0_MOSI (in), SPI0_SCLK (in), SPI0_SS1 (in)

### Nets
3.0VREF: C234.1 D5.1(K) R99.2 TP29.1 U21.15(REF+)
3.3V: C215.1 C216.1 C220.1 L11.2 R99.1 U21.23(OVDD)
GND: C201.2 C202.2 C203.2 C204.2 C205.2 C206.2 C207.2 C208.2 C209.2 C210.2 C211.2 C212.2 C213.2 C214.2 C215.2 C216.2 C217.2 C218.2 C219.2 C220.2 C222.2 C223.2 C234.2 D5.2(A) U21.14(GND) U21.16(GND) U21.22(DGND) U21.29(EP)
ADC_AIN0: C201.1 R83.2 TP18.1 U21.26(AIN0)
ADC_AIN1: C202.1 R84.2 TP19.1 U21.27(AIN1)
ADC_AIN2: C203.1 R85.2 TP20.1 U21.28(AIN2)
ADC_AIN3: C204.1 R86.2 TP21.1 U21.1(AIN3)
ADC_AIN4: C206.1 R88.2 TP22.1 U21.2(AIN4)
ADC_AIN5: C208.1 R90.2 TP25.1 U21.3(AIN5)
ADC_AIN6: C210.1 R92.2 TP27.1 U21.4(AIN6)
ADC_AIN7: C205.1 R87.2 TP23.1 U21.5(AIN7)
ADC_AIN8: C207.1 R89.2 TP24.1 U21.6(AIN8)
ADC_AIN9: C209.1 R91.2 TP26.1 U21.7(AIN9)
ADC_AIN10: C211.1 R93.2 TP28.1 U21.8(AIN10)
ADC_AIN11: C212.1 R94.2 TP31.1 U21.9(AIN11)
ADC_AIN12: C213.1 R95.2 TP33.1 U21.10(AIN12)
ADC_AIN13: C214.1 R96.2 TP34.1 U21.11(AIN13)
ADC_AIN14: C222.1 R97.2 TP30.1 U21.12(CNVST/AIN14)
ADC_AIN15: C223.1 R98.2 TP32.1 U21.13(REF-/AIN15)
ADC_EOC: U21.25(EOC) ; port ADC_EOC
ADC_IN0: R83.1 ; port ADC_IN0
ADC_IN1: R84.1 ; port ADC_IN1
ADC_IN2: R85.1 ; port ADC_IN2
ADC_IN3: R86.1 ; port ADC_IN3
ADC_IN4: R88.1 ; port ADC_IN4
ADC_IN5: R90.1 ; port ADC_IN5
ADC_IN6: R92.1 ; port ADC_IN6
ADC_IN7: R87.1 ; port ADC_IN7
ADC_IN8: R89.1 ; port ADC_IN8
ADC_IN9: R91.1 ; port ADC_IN9
ADC_IN10: R93.1 ; port ADC_IN10
ADC_IN11: R94.1 ; port ADC_IN11
ADC_IN12: R95.1 ; port ADC_IN12
ADC_IN13: R96.1 ; port ADC_IN13
ADC_IN14: R97.1 ; port ADC_IN14
ADC_IN15: R98.1 ; port ADC_IN15
ADC_VDD_3V3: C217.1 C218.1 C219.1 L11.1 U21.17(VDD) U21.18(VDD)
SPI0_MISO_SLAVE1: U21.24(DOUT) ; port SPI0_MISO_SLAVE1
SPI0_MOSI: U21.21(DIN) ; port SPI0_MOSI
SPI0_SCLK: U21.19(SCLK) ; port SPI0_SCLK
SPI0_SS1: U21.20(CS) ; port SPI0_SS1

### Layout directives
net class Power_3V3: ADC_VDD_3V3
net class ADC_IN(0-15): ADC_AIN0, ADC_AIN1, ADC_AIN2, ADC_AIN3, ADC_AIN4, ADC_AIN5, ADC_AIN6, ADC_AIN7, ADC_AIN8, ADC_AIN9, ADC_AIN10, ADC_AIN11, ADC_AIN12, ADC_AIN13, ADC_AIN14, ADC_AIN15, ADC_IN0, ADC_IN1, ADC_IN2, ADC_IN3, ADC_IN4, ADC_IN5, ADC_IN6, ADC_IN7, ADC_IN8, ADC_IN9, ADC_IN10, ADC_IN11, ADC_IN12, ADC_IN13, ADC_IN14, ADC_IN15

### Notes on the sheet
- MAX11131 DOUT pin is driven by a tri-state buffer.
  When CS is low, DOUT is high impedance.
- DIGITAL SUPPLY
- (near L11) ANALOG SUPPLY
- ANALOG REFERENCE
- (near D5) REF+ input current 110uA
  ADR5043 Minimum operating current 60uA
- Routed to headers.
  Any buffering will be done on the daughter board.
- REV.
- DESCRIPTION
- DATE
- APPROVED
- Incal Inc.
- SHEET
- TITLE
- CONFIG.
- PROJECT
- SIZE
- SCH P/N.
- DRAWN
- B
- OF

### Library data of the parts
C201-C214 C222 C223 = C0201_1000pF_10%_25V_X5R: Capacitor ceramic, X5R, 1000pF, 25V, 10%, -55 to +85 C, EIA0201; Manufacturer 1: TDK; Mfg Part Number 1: C0603X5R1E102K030BA; EIA(I) Package: 0201; EIA(M) Package: 0603; ASSY: USED; Status: Active; Power: *; Current: *; Part Ref: C0201_1000pF_10%_25V_X5R; Comment_1: *; RoHs: True; Operating Temp: -55 to +85 C
C215 C218 C220 = C0603_10uF_10%_10V_X5R: as C244 on sheet Power; Status: Active; Power: *; Current: *; Part Ref: C0603_10uF_10%_10V_X5R; Comment_1: *; RoHs: True; Operating Temp: -55 to +85 C
C216 C217 C219 = C0201_0.1uF_10%_6.3V_X5R: as C245 on sheet Power; Status: Active; Power: *; Current: *; Part Ref: C0201_0.1uF_10%_6.3V_X5R; Comment_1: *; RoHs: True; Operating Temp: -55 to +85 C
C234 = C0402_0.47uF_10%_10V_X5R: Capacitor ceramic, X5R, 0.47uF, 10V, 10%, -55 to +85 C, EIA0402; Manufacturer 1: MURATA; Mfg Part Number 1: GRM155R61A474KE15D; EIA(I) Package: 0402; EIA(M) Package: 1005; ASSY: USED; Status: Active; Power: *; Current: *; Part Ref: C0402_0.47uF_10%_10V_X5R; Comment_1: *; RoHs: True; Operating Temp: -55 to +85 C; Datasheet 1: ..\datasheet\Capacitor\Murata\GRM_Serie\GRM155R61A_X5R\2012-10-27
D5 = ADR5043BKSZ-R2: Reference Shunt 3.0V, 3-lead SC70; Manufacturer 1: Analog Devices; Current: 15mA; Tolerance: 0.1%; ASSY: USED; Status: Active; Power: *; EIA(I) Package: *; EIA(M) Package: *; Part Ref: ADR5043BKSZ-R2; Comment_1: *; RoHs: True; Package: SC70; Voltage: 3.0V; Operating Temp: -40 to +125 C
L11 = BLM21PG221SN1D: Ferrite chip, 220 Ohm @ 100MHz, 2000mA, 25%, -55 to +125 C, 0805; Manufacturer 1: Murata; EIA(I) Package: 0805; EIA(M) Package: 2012; ASSY: USED; Status: Active; Power: *; Part Ref: BLM21PG221SN1D; Voltage: *; Comment_1: *; RoHs: True; Tolerance: 25%; Operating Temp: -55 to +125 C
R83-R98 = R0201_10R0_1%: Resistor, 10R0, 1/20W, 1%, -50 to +155 C, EIA0201, EIA(M)0603; Manufacturer 1: Yageo; Mfg Part Number 1: RC0201FR-0710RL; EIA(I) Package: 0201; EIA(M) Package: 0603; Voltage: 50V; ASSY: USED; Status: Active; Part Ref: R0201_10R0_1%; Current: *; Comment_1: *; RoHs: True; Package: 0201; Operating Temp: -50 to +155 C
R99 = R0402_1k00_1%: as R47 on sheet Power; Status: Active; Part Ref: R0402_1k00_1%; Current: *; Comment_1: *; RoHs: True; Operating Temp: -55 to +155 C; Datasheet 1: ..\datasheet\Resistor\Yaego\Thick_Film\RC0402\2012-03-29; Manufacturer 2: Vishay Dale; Mfg Part Number 2: CRCW04021k00FKED; Datasheet 2: ..\datasheet\Resistor\Vishay Dale\CRC\2012-03-29
TP18-TP28 TP30-TP34 = 5004: Test point bead, yellow, Keystone Electronics, Thru-hole,; Manufacturer 1: Keystone inc; ASSY: USED; Power: Pow; Current: Cur; Voltage: Vol; Comment_1: Com; Status: Active; EIA(I) Package: *; EIA(M) Package: *; Part Ref: 5004; Tolerance: *; Package: *; RoHs: True; Mfg Part Number 1: 5004; Datasheet 1: ..\datasheet\Connector\Keystone Electronics\5001-5014\2012-06-28
TP29 = 5000: as TP2 on sheet Power; Status: Active; EIA(I) Package: *; EIA(M) Package: *; Part Ref: 5000; Tolerance: *; Package: *; RoHs: True; Mfg Part Number 1: 5000; Datasheet 1: ..\datasheet\Connector\Keystone Electronics\5001-5014\2012-06-28
U21 = MAX11131ATI+T: ADC 12bit, 3Msps, 16 channels,2.35V to 3.6V, TQFN, -40 to +125 C; Manufacturer 1: Maxim; PART NUMBER: MAX11131ATI+T; Part Ref: MAX11131ATI+T; Status: Active; RoHs: True; Value: MAX11131ATI+T; Mfg Part Number 1: MAX11131ATI+T; Package: TQFN28

## Sheet DAC.SchDoc: 02290_Sonoma_Controller
size B; ApprovedBy: J Johnson; CheckedBy: J Johnson; Author: sdfasdfdfAEFfasdFfaF; DrawnBy: J Johnson; Organization: Opsero Electronic Design; Address1: 21-915 Av. Marguerite-Bourgeoys; Address2: Québec (QC); Address3: G1S 3X4; DocumentNumber: OP009-001-SCH; Revision: B-1; SheetNumber: 16; SheetTotal: 16; Tel1: (581) 308-8830; Tel2: (581) 308-8830; Project: 02290_Sonoma_Controller; CheckedDate: 2013-12-13; Sheet: DAC 10-bit 10-channel; PageSetup: Record=PageOptions|CenterHorizontal=True|CenterVertical=True|PrintScale=1.08|XCorrection=1.00|YCorrection=1.00|PrintKind=0|BorderSize=5000000|LeftOffset=0|BottomOffset=0|Orientation=2|PaperLength=1000|PaperWidth=1000|Scale=100|PaperSource=7|PrintQuality=-4|MediaType=1|DitherType=10|PaperKind=Tabloid     [11 x 17 in]|PrintScaleMode=1; DrawDate: 2013-12-13; SchTitle: 02290_Sonoma_Controller; RevDescription: Removed QSPI, JP4/5, temp mon, JP6, U31; RevDate: 2019-05-24; RevBy: J Johnson; RevDescription2: Replaced D1 with RB521S30, J2 with L834-1G1T-S7; RevDescription3: Replaced FETs with TSM900N06CW RPG
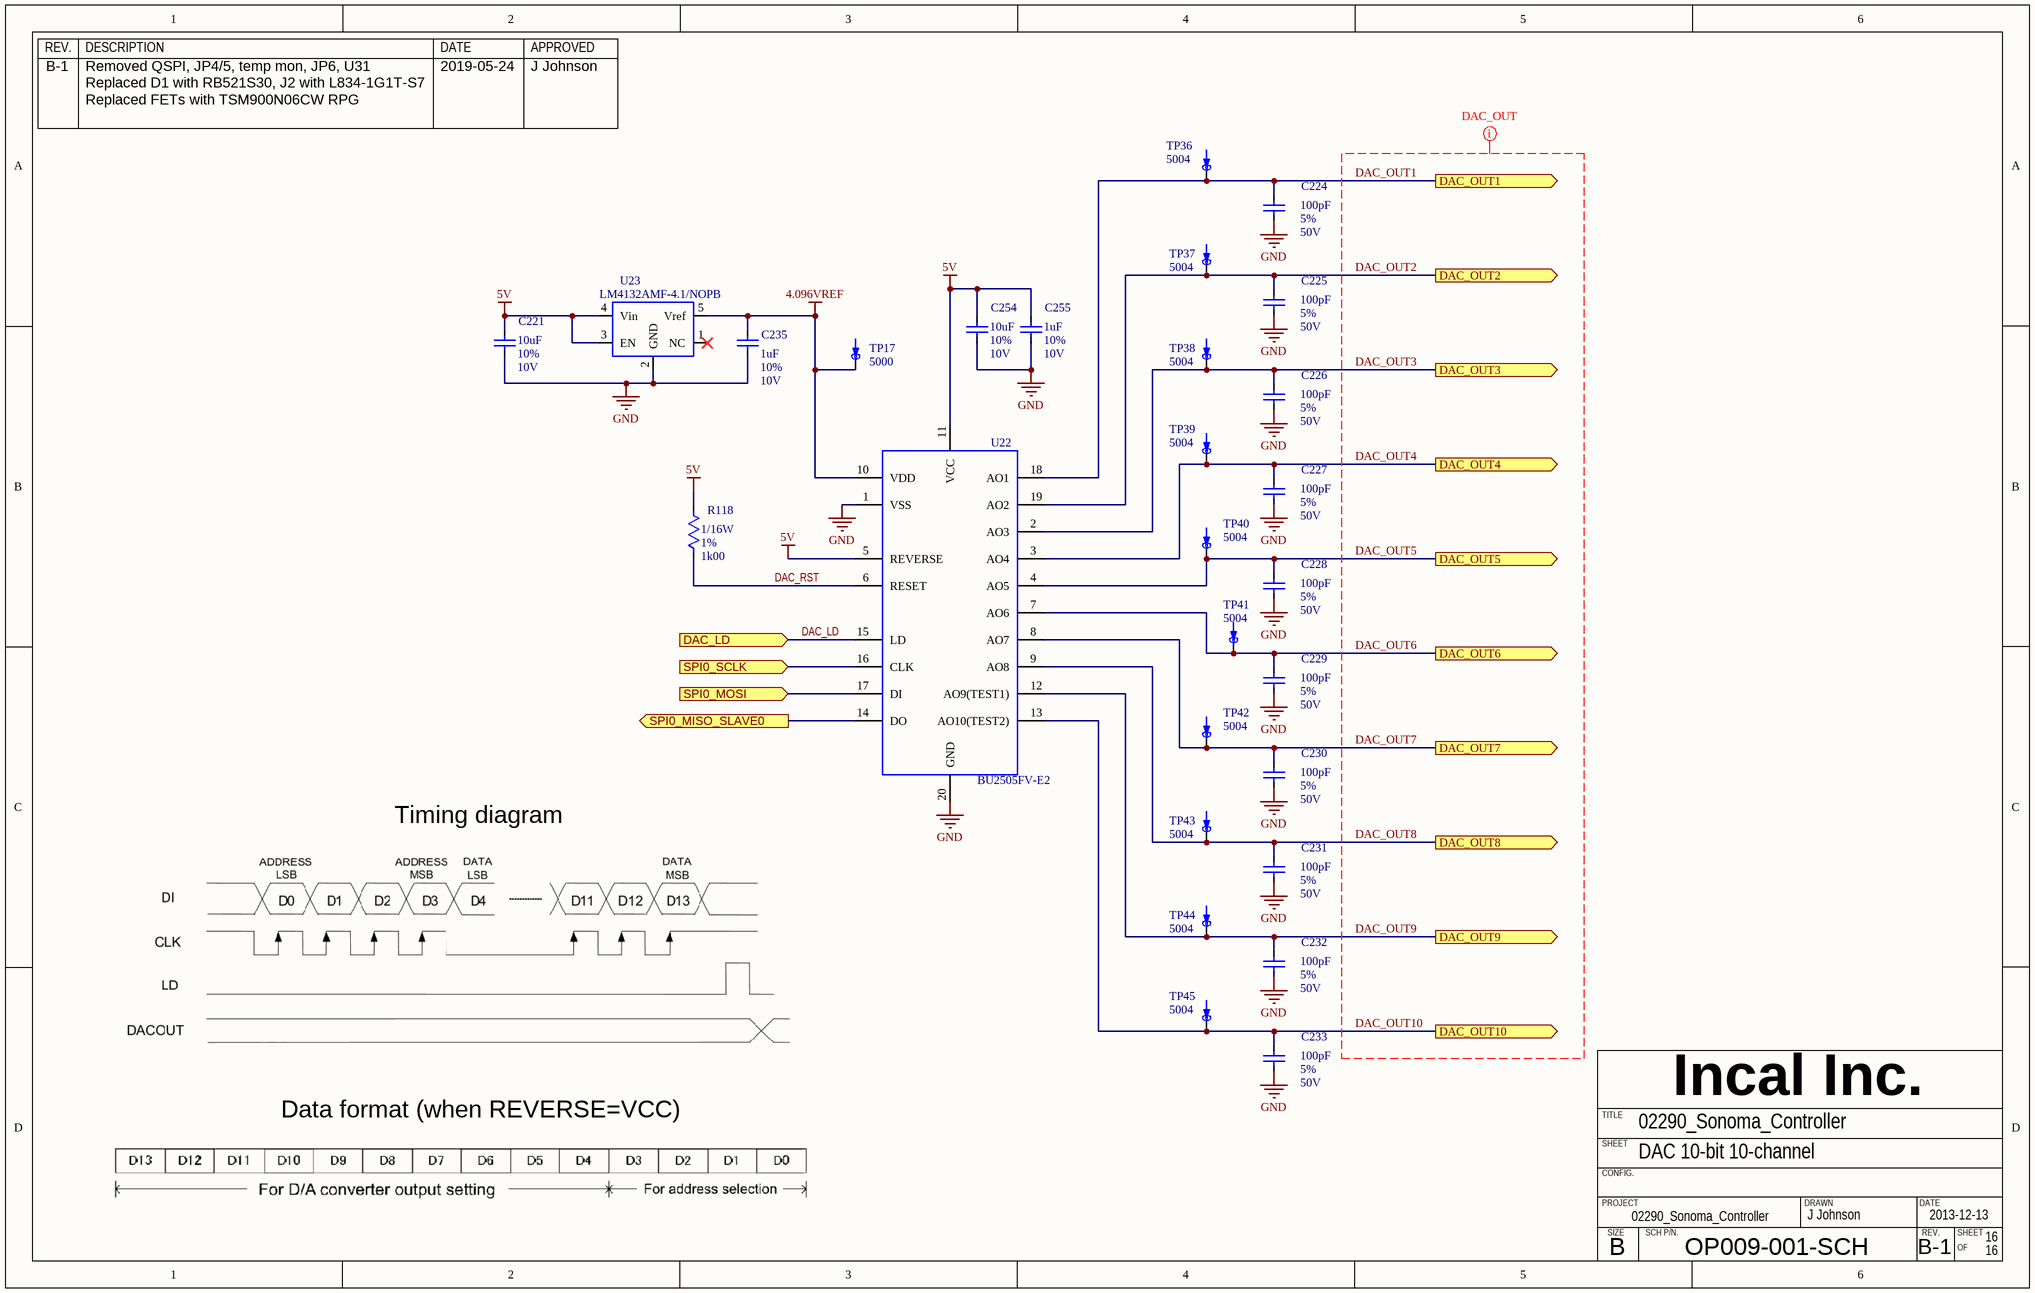
[diagram p5: DAC.SchDoc]

### Parts
C221  value 10uF  Tolerance: 10%  Voltage: 10V  [CAPC1608X38N]  (hidden comment: CAPACITOR_NP_TYPE1)
C224  value 100pF  Tolerance: 5%  Voltage: 50V  [CAPC1005X33N]  (hidden comment: CAPACITOR_NP_TYPE1)
C225  value 100pF  Tolerance: 5%  Voltage: 50V  [CAPC1005X33N]  (hidden comment: CAPACITOR_NP_TYPE1)
C226  value 100pF  Tolerance: 5%  Voltage: 50V  [CAPC1005X33N]  (hidden comment: CAPACITOR_NP_TYPE1)
C227  value 100pF  Tolerance: 5%  Voltage: 50V  [CAPC1005X33N]  (hidden comment: CAPACITOR_NP_TYPE1)
C228  value 100pF  Tolerance: 5%  Voltage: 50V  [CAPC1005X33N]  (hidden comment: CAPACITOR_NP_TYPE1)
C229  value 100pF  Tolerance: 5%  Voltage: 50V  [CAPC1005X33N]  (hidden comment: CAPACITOR_NP_TYPE1)
C230  value 100pF  Tolerance: 5%  Voltage: 50V  [CAPC1005X33N]  (hidden comment: CAPACITOR_NP_TYPE1)
C231  value 100pF  Tolerance: 5%  Voltage: 50V  [CAPC1005X33N]  (hidden comment: CAPACITOR_NP_TYPE1)
C232  value 100pF  Tolerance: 5%  Voltage: 50V  [CAPC1005X33N]  (hidden comment: CAPACITOR_NP_TYPE1)
C233  value 100pF  Tolerance: 5%  Voltage: 50V  [CAPC1005X33N]  (hidden comment: CAPACITOR_NP_TYPE1)
C235  value 1uF  Tolerance: 10%  Voltage: 10V  [CAPC1005X33N]  (hidden comment: CAPACITOR_NP_TYPE1)
C254  value 10uF  Tolerance: 10%  Voltage: 10V  [CAPC1608X38N]  (hidden comment: CAPACITOR_NP_TYPE1)
C255  value 1uF  Tolerance: 10%  Voltage: 10V  [CAPC1005X33N]  (hidden comment: CAPACITOR_NP_TYPE1)
R118  value 1k00  Power: 1/16W  Tolerance: 1%  [RESC1005X33N]  (hidden comment: *)
TP17  value 5000  [KEY_5000]  (hidden comment: TEST_POINT_TYPE4)
TP36  value 5004  [KEY_5004]  (hidden comment: TEST_POINT_TYPE4)
TP37  value 5004  [KEY_5004]  (hidden comment: TEST_POINT_TYPE4)
TP38  value 5004  [KEY_5004]  (hidden comment: TEST_POINT_TYPE4)
TP39  value 5004  [KEY_5004]  (hidden comment: TEST_POINT_TYPE4)
TP40  value 5004  [KEY_5004]  (hidden comment: TEST_POINT_TYPE4)
TP41  value 5004  [KEY_5004]  (hidden comment: TEST_POINT_TYPE4)
TP42  value 5004  [KEY_5004]  (hidden comment: TEST_POINT_TYPE4)
TP43  value 5004  [KEY_5004]  (hidden comment: TEST_POINT_TYPE4)
TP44  value 5004  [KEY_5004]  (hidden comment: TEST_POINT_TYPE4)
TP45  value 5004  [KEY_5004]  (hidden comment: TEST_POINT_TYPE4)
U22  BU2505FV-E2  [SSOP65P440X650X115-20N]
U23  Mfg Part Number 1: LM4132AMF-4.1/NOPB  [SOT65P280X145-5AN]  (hidden comment: LM4132)

### Ports
DAC_LD (in), DAC_OUT1 (out), DAC_OUT2 (out), DAC_OUT3 (out), DAC_OUT4 (out), DAC_OUT5 (out), DAC_OUT6 (out), DAC_OUT7 (out), DAC_OUT8 (out), DAC_OUT9 (out), DAC_OUT10 (out), SPI0_MISO_SLAVE0 (out), SPI0_MOSI (in), SPI0_SCLK (in)

### Nets
4.096VREF: C235.1 TP17.1 U22.10(VDD) U23.5(Vref)
5V: C221.1 C254.1 C255.1 R118.2 U22.5(REVERSE) U22.11(VCC) U23.3(EN) U23.4(Vin)
GND: C221.2 C224.2 C225.2 C226.2 C227.2 C228.2 C229.2 C230.2 C231.2 C232.2 C233.2 C235.2 C254.2 C255.2 U22.1(VSS) U22.20(GND) U23.2(GND)
DAC_LD: U22.15(LD) ; port DAC_LD
DAC_OUT1: C224.1 TP36.1 U22.18(AO1) ; port DAC_OUT1
DAC_OUT2: C225.1 TP37.1 U22.19(AO2) ; port DAC_OUT2
DAC_OUT3: C226.1 TP38.1 U22.2(AO3) ; port DAC_OUT3
DAC_OUT4: C227.1 TP39.1 U22.3(AO4) ; port DAC_OUT4
DAC_OUT5: C228.1 TP40.1 U22.4(AO5) ; port DAC_OUT5
DAC_OUT6: C229.1 TP41.1 U22.7(AO6) ; port DAC_OUT6
DAC_OUT7: C230.1 TP42.1 U22.8(AO7) ; port DAC_OUT7
DAC_OUT8: C231.1 TP43.1 U22.9(AO8) ; port DAC_OUT8
DAC_OUT9: C232.1 TP44.1 U22.12(AO9(TEST1)) ; port DAC_OUT9
DAC_OUT10: C233.1 TP45.1 U22.13(AO10(TEST2)) ; port DAC_OUT10
DAC_RST: R118.1 U22.6(RESET)
SPI0_MISO_SLAVE0: U22.14(DO) ; port SPI0_MISO_SLAVE0
SPI0_MOSI: U22.17(DI) ; port SPI0_MOSI
SPI0_SCLK: U22.16(CLK) ; port SPI0_SCLK

Not connected (* = marked no-connect by the designer): U23 1(NC)*

### Layout directives
net class DAC_OUT(1_10): DAC_OUT1, DAC_OUT2, DAC_OUT3, DAC_OUT4, DAC_OUT5, DAC_OUT6, DAC_OUT7, DAC_OUT8, DAC_OUT9, DAC_OUT10

### Notes on the sheet
- Timing diagram
- Data format (when REVERSE=VCC)
- REV.
- DESCRIPTION
- DATE
- APPROVED
- Incal Inc.
- SHEET
- TITLE
- CONFIG.
- PROJECT
- SIZE
- SCH P/N.
- DRAWN
- B
- OF

### Library data of the parts
C221 C254 = C0603_10uF_10%_10V_X5R: as C244 on sheet Power; Status: Active; Power: *; Current: *; Part Ref: C0603_10uF_10%_10V_X5R; Comment_1: *; RoHs: True; Operating Temp: -55 to +85 C
C224-C233 = C0402_100pF_5%_50V_C0G: Capacitor ceramic, C0G (NP0), 100pF, 50V, 5%, -55 to +125 C, EIA0402; Manufacturer 1: Murata; Mfg Part Number 1: GRM1555C1H101JA01D; EIA(I) Package: 0402; EIA(M) Package: 1005; ASSY: USED; Status: Active; Power: *; Current: *; Part Ref: C0402_100pF_5%_50V_C0G; Comment_1: *; RoHs: True; Operating Temp: -55 to +125 C; Datasheet 1: ..\datasheet\Capacitor\Murata\GRM_Serie\Series catalog\2013-04-30
C235 C255 = C0402_1uF_10%_10V_X5R: Capacitor ceramic, X5R, 1uF, 10V, 10%, -55 to +85 C, EIA0402; Manufacturer 1: Murata; Mfg Part Number 1: GRM155R61A105KE15J; EIA(I) Package: 0402; EIA(M) Package: 1005; ASSY: USED; Status: Active; Power: *; Current: *; Part Ref: C0402_1uF_10%_10V_X5R; Comment_1: *; RoHs: True; Operating Temp: -55 to +85 C
R118 = R0402_1k00_1%: as R47 on sheet Power; Status: Active; Part Ref: R0402_1k00_1%; Current: *; Comment_1: *; RoHs: True; Operating Temp: -55 to +155 C; Datasheet 1: ..\datasheet\Resistor\Yaego\Thick_Film\RC0402\2012-03-29; Manufacturer 2: Vishay Dale; Mfg Part Number 2: CRCW04021k00FKED; Datasheet 2: ..\datasheet\Resistor\Vishay Dale\CRC\2012-03-29
TP17 = 5000: as TP2 on sheet Power; Status: Active; EIA(I) Package: *; EIA(M) Package: *; Part Ref: 5000; Tolerance: *; Package: *; RoHs: True; Mfg Part Number 1: 5000; Datasheet 1: ..\datasheet\Connector\Keystone Electronics\5001-5014\2012-06-28
TP36-TP45 = 5004: as TP18 on sheet ADC; Status: Active; EIA(I) Package: *; EIA(M) Package: *; Part Ref: 5004; Tolerance: *; Package: *; RoHs: True; Mfg Part Number 1: 5004; Datasheet 1: ..\datasheet\Connector\Keystone Electronics\5001-5014\2012-06-28
U22 = BU2505FV-E2: DAC 10 bit, High precision, 10 channel, 4.5 to 5.5V, -30 to +85C; Manufacturer 1: Rohm; PART NUMBER: BU2505FV-E2; Part Ref: BU2505FV-E2; Status: Active; RoHs: True; Value: BU2505FV-E2; Mfg Part Number 1: BU2505FV-E2; Package: SSOP-20
U23 = LM4132AMF-4.1/NOPB: Reference 4.096V low dropout, 20mA, 10ppm, 0.05%; Manufacturer 1: TI; ASSY: USED; Power: Pow; Voltage: 5.5V; Value: 3.3; Status: Active; EIA(I) Package: *; EIA(M) Package: *; Part Ref: LM4132AMF-4.1/NOPB; Current: 20mA; Tolerance: ±0.05%; Package: SOT23-5; RoHs: True; Operating Temp: -40 to +125 C; Datasheet 1: ..\datasheet\Reference\lm4132\2012-12-04\

## Nets that join several sheets
1.5V: DDR3B (37 pins), Power (8 pins)
1.8V: DDR3B (C43.1 U4.2), Power (6 pins)
3.3V: DDR3B (C41.1 R33.1 R34.1 U4.10), QSPIFlash (30 pins), Power (10 pins), ADC (6 pins)
5V: Power (6 pins), DAC (8 pins)
GND: DDR3B (57 pins), QSPIFlash (29 pins), Power (64 pins), ADC (28 pins), DAC (17 pins)

## Assembly variants
Standard: not fitted C103 C104 Q1 R118